# Altium schematic sheet 07_POWER-RAILS.SchDoc
size A4; CheckedBy: Inženjer 2; CompanyName: Byte Lab Grupa d.o.o.; Engineer: Matija Puskar; Organization: Byte Lab Grupa d.o.o.; Address1: Medarska 69/1, 10000 Zagreb, Croatia; DocumentNumber: 1; SheetNumber: 7; SheetTotal: 7; Web: www.byte-lab.com; ProjectName: P1X-0XX
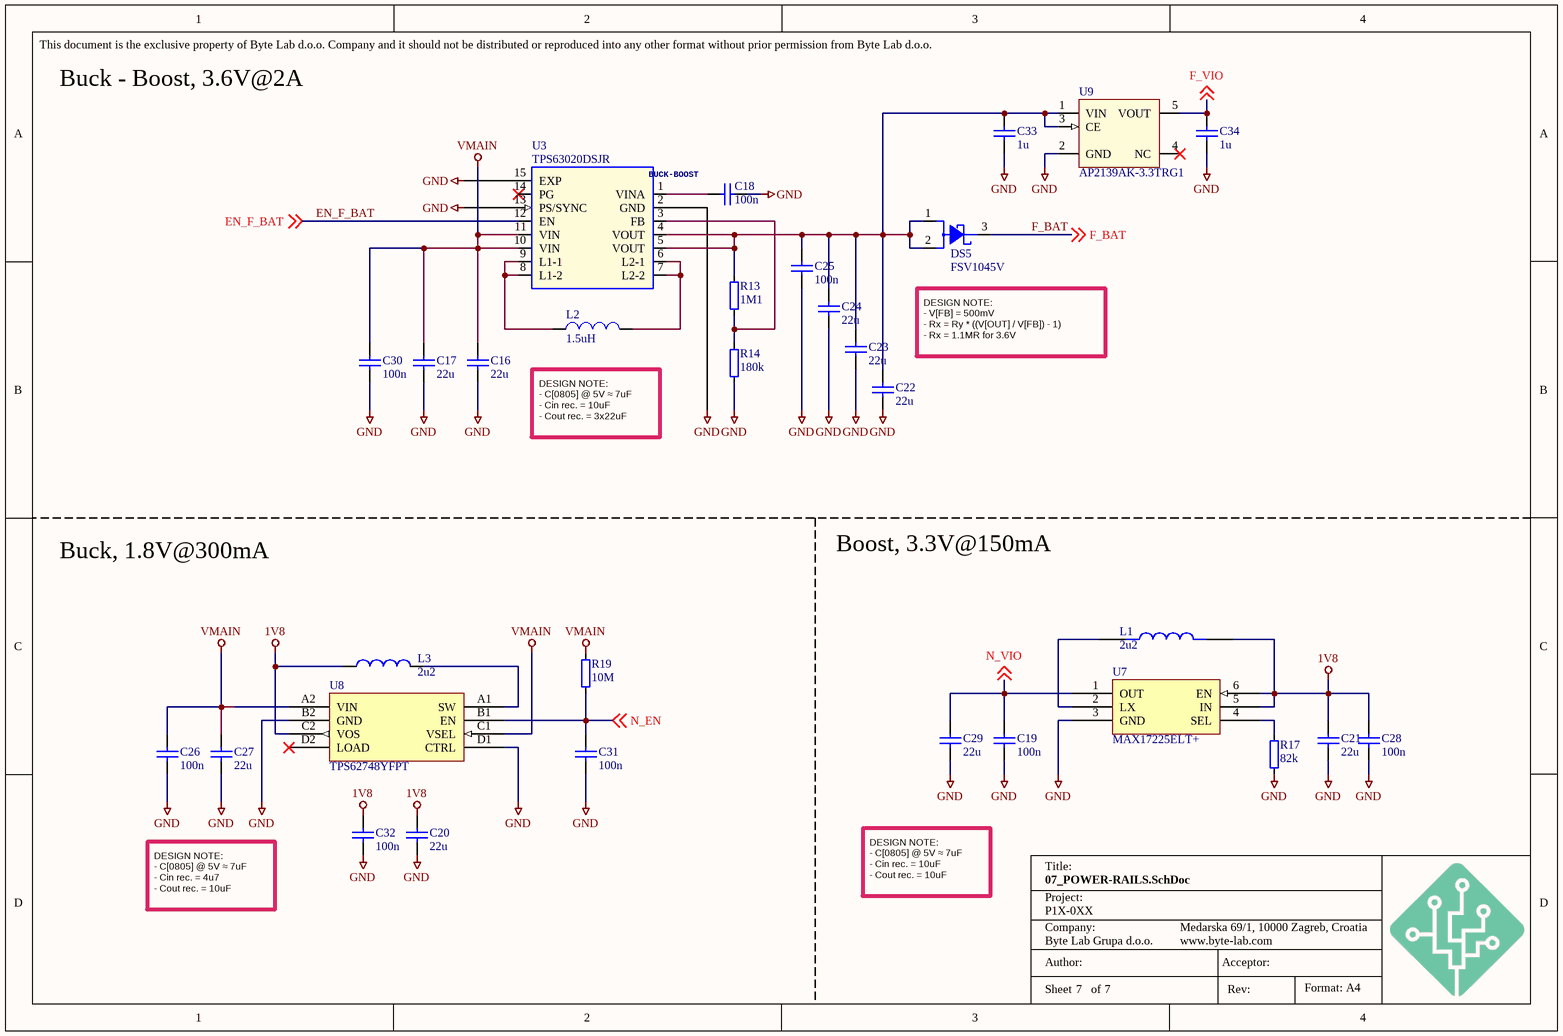
[diagram p0: 07_POWER-RAILS.SchDoc]

## Parts
C16  22u  [C-0805]
C17  22u  [C-0805]
C18  100n  [C-0402]
C19  100n  [C-0402]
C20  22u  [C-0805]
C21  22u  [C-0805]
C22  22u  [C-0805]
C23  22u  [C-0805]
C24  22u  [C-0805]
C25  100n  [C-0402]
C26  100n  [C-0402]
C27  22u  [C-0805]
C28  100n  [C-0402]
C29  22u  [C-0805]
C30  100n  [C-0402]
C31  100n  [C-0402]
C32  100n  [C-0402]
C33  1u  [C-0603]
C34  1u  [C-0603]
DS5  FSV1045V  [TO277-3]
L1  2u2  [IND_XFL4020-222MEC]
L2  1.5uH  [VCHA042A-1R5MS6]
L3  2u2  [1285AS-H-2R2M=P2-INDC2016X100N]
R13  1M1  [R-0402]
R14  180k  [R-0402]
R17  82k  [R-0402]
R19  10M  [R-0402]
U3  TPS63020DSJR  [TI PVSON-14 DSJ]
U7  MAX17225ELT+  [MAX17225ELT+UDFN]
U8  TPS62748YFPT  [TPS62748YFPT-DSBGA4x2]
U9  AP2139AK-3.3TRG1  [SOT-23-5(M5)]

## Nets
1V8: C20.1 C21.2 C28.2 C32.2 L1.2 L3.1 U7.5(IN) U7.6(EN) U8.C2(VOS)
GND: C16.1 C17.1 C18.1 C19.1 C20.2 C21.1 C22.2 C23.2 C24.2 C25.1 C26.1 C27.1 C28.1 C29.2 C30.1 C31.1 C32.1 C33.1 C34.1 R14.1 R17.2 U3.2(GND) U3.13(PS/SYNC) U3.15(EXP) U7.3(GND) U8.B2(GND) U8.D1(CTRL) U9.2(GND)
VMAIN: C16.2 C17.2 C26.2 C27.2 C30.2 R19.2 U3.10(VIN) U3.11(VIN) U8.A2(VIN) U8.C1(VSEL)
EN_F_BAT: U3.12(EN) ; off-sheet EN_F_BAT
F_BAT: DS5.3(C) ; off-sheet F_BAT
F_VIO: C34.2 U9.5(VOUT) ; off-sheet F_VIO
N_EN: C31.2 R19.1 U8.B1(EN) ; off-sheet N_EN
N_VIO: C19.2 C29.1 U7.1(OUT) ; off-sheet N_VIO
NetC18_2: C18.2 U3.1(VINA)
NetC22_1: C22.1 C23.1 C24.1 C25.2 C33.2 DS5.1(A1) DS5.2(A2) R13.2 U3.4(VOUT) U3.5(VOUT) U9.1(VIN) U9.3(CE)
NetL1_1: L1.1 U7.2(LX)
NetL2_1: L2.1(C) U3.6(L2-1) U3.7(L2-2)
NetL2_2: L2.2(A) U3.8(L1-2) U3.9(L1-1)
NetL3_2: L3.2 U8.A1(SW)
NetR13_1: R13.1 R14.2 U3.3(FB)
NetR17_1: R17.1 U7.4(SEL)

Not connected (* = marked no-connect by the designer): U3 14(PG)*; U8 D2(LOAD)*; U9 4(NC)*

## Notes on the sheet
- Buck - Boost, 3.6V@2A
- DESIGN NOTE:
  - V[FB] = 500mV
  - Rx = Ry * ((V[OUT] / V[FB]) - 1)
  - Rx = 1.1MR for 3.6V
- DESIGN NOTE:
  - C[0805] @ 5V ≈ 7uF
  - Cin rec. = 10uF
  - Cout rec. = 3x22uF
- Buck, 1.8V@300mA
- Boost, 3.3V@150mA
- DESIGN NOTE:
  - C[0805] @ 5V ≈ 7uF
  - Cin rec. = 4u7
  - Cout rec. = 10uF
- DESIGN NOTE:
  - C[0805] @ 5V ≈ 7uF
  - Cin rec. = 10uF
  - Cout rec. = 10uF
- This document is the exclusive property of Byte Lab d.o.o. Company and it should not be distributed or reproduced into any other format without prior permission from Byte Lab d.o.o.
- Project:
- Title:
- Author:
- Company:
- Acceptor:
- Format: A4
- Sheet
- of
- Rev:
- (in symbol BUCK-BOOST - TPS63020DSJR) BUCK-BOOST

## Library data of the parts
C16 C17 C20-C24 C27 C29 = C0805-22u-16V-X5R: Capacitor ceramic 22u ±10% X5R 16V 0805; BL Part Number: 2006-222; Drawn_By: Fumic; Checked_By: Hamin; Manufacturer: N/A; Note: *; Manufacturer Part Number: N/A; DateModified: 28-07-2022
C18 C19 C25 C26 C28 C30-C32 = C0402-100n-16V-X7R: Capacitor ceramic 100n ±10% X7R 16V 0402; BL Part Number: 2000-908; Drawn_By: Puskar; Checked_By: Dodig; Manufacturer: N/A; Supplier 1: Digi-Key; Supplier Part Number 1: 490-3261-1-ND; Note: *; Manufacturer Part Number: N/A; DateModified: 27-08-2013
C33 C34 = C0603-1u-25V-X5R: Capacitor ceramic 1u ±10% X5R 25V; Manufacturer: Yageo; BL Part Number: 2006-223; Manufacturer Part Number: CC0603KRX5R8BB105; Drawn_By: Hamin; Checked_By: Golubic; Supplier 1: Digi-Key; Supplier Part Number 1: 311-1445-1-ND; Note: *; DateModified: 2022-10-07
DS5 = SCHOTTKY - FSV1045V - 10A/45V: DIODO SCHOTTKY 10A 45V FSV1045V TO277-3 SMT; BL Part Number: 2007-712; Manufacturer: onsemi; Drawn_By: Blues Wireless; Supplier 1: Digi-Key; Supplier Part Number 1: FSV1045VCT-ND; Manufacturer Part Number: FSV1045V
L1 = XFL4020-222MEC: Power Inductors - SMD 2.2Uh Shld 8A 23.5mOhms AECQ2; Manufacturer 1: Coilcraft; BL Part Number: 2007-483; Drawn_By: Blues Wireless; Manufacturer Part Number 1: XFL4020-222MEC; Supplier 1: Mouser; Supplier Part Number 1: 994-XFL4020-222MEC
L2 = VCHA042A-1R5MS6: Fixed Ind 1.5UH 7.3A 15.4 Mohm; Manufacturer: Cyntec; BL Part Number: 2007-451; Drawn_By: Blues Wireless; Supplier 1: Digi-Key; Manufacturer Part Number: VCHA042A-1R5MS6; Supplier Part Number 1: 2037-VCHA042A-1R5MS6CT-ND
L3 = 1285AS-H-2R2M=P2: FIXED IND 2.2UH 1.5A 204MOHM SMD; Manufacturer: Murata Electronics; BL Part Number: 2007-482; Drawn_By: Blues Wireless; Supplier 1: Digi-Key; Manufacturer Part Number: 1285AS-H-2R2M=P2; Supplier Part Number 1: 490-10600-1-ND
R13 = R0402-1M1-1: Resistor 1M1 ±1% 0402; BL Part Number: 2000-730; Drawn_By: Hamin; Supplier 1: Digi-Key; Manufacturer: N/A; Manufacturer Part Number: N/A; Supplier Part Number 1: 13-RC0402FR-071M1LCT-ND; DateModified: 03-05-2023; Checked_By: *; Note: *
R14 = R0402-180k-1: Resistor 180k ±1% 0402; BL Part Number: 2001-422; Checked_By: Hamin; Drawn_By: Dodig; Manufacturer: N/A; Manufacturer Part Number: N/A; DateModified: 15-02-2018; Note: *
R17 = R0402-82k-1: Resistor 82k ±1% 0402; Manufacturer: Yageo; Manufacturer Part Number: RC0402FR-0782KL; BL Part Number: 2001-566; Checked_By: Hamin; Drawn_By: Puskar; Supplier 1: Digi-key; Supplier Part Number 1: 311-82.0KLRCT-ND; DateModified: 20-08-2014; Note: *
R19 = R0402-10M-1: Resistor 10M ±1% 0402; BL Part Number: 2002-832; Checked_By: Dodig; Drawn_By: Zvonc; Supplier 1: Digi-Key; Manufacturer: N/A; Manufacturer Part Number: N/A; Supplier Part Number 1: RC0402FR-0710ML; DateModified: 24-05-2016; Note: *
U3 = BUCK-BOOST - TPS63020DSJR: I.C. DC/DC CONVERTER TPS63020DSJR TEXAS VSON14 SMT; BL Part Number: 2002-405; Manufacturer: Texas Instruments; Drawn_By: Blues Wireless; Supplier 1: Digi-Key; Supplier Part Number 1: 296-36491-1-ND; Manufacturer Part Number: TPS63020DSJR
U7 = MAX17225ELT+: IC REG BOOST ADJ 1A NANO 6UDFN; Manufacturer: Maxim; BL Part Number: 2007-481; Drawn_By: Blues Wireless; Supplier 1: Digi-Key; Manufacturer Part Number: MAX17225ELT+; Supplier Part Number 1: MAX17225ELT+ -ND
U8 = TPS62748YFPT: IC REG BUCK PROG 300MA 8DSBGA; Manufacturer: Texas Instruments; BL Part Number: 2007-480; Drawn_By: Blues Wireless; Supplier 1: Digi-Key; Manufacturer Part Number: TPS62748YFPT; Supplier Part Number 1: 296-43000-1-ND
U9 = AP2139AK-3.3TRG1: IC REG LINEAR 3.3V 250MA SOT23-5; Manufacturer: Diodes Incorporated; BL Part Number: 2006-845; Checked_By: Hlupic; Drawn_By: Marsic; DateModified: 29-09-2022; Manufacturer Part Number: AP2139AK-3.3TRG1; Note: *